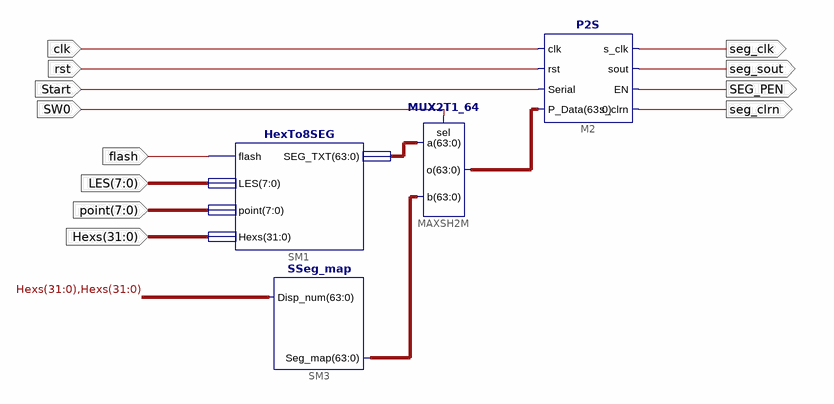
[diagram p0: schematic sheet 1]
// Xilinx ISE schematic SSeg7_Dev.sch (kintex7) as structural Verilog: 4 symbols, 12 ports
module SSeg7_Dev (
  input  Start,
  input  rst,
  input  clk,
  input  SW0,
  input  flash,
  input  [31:0] Hexs,
  input  [7:0] point,
  input  [7:0] LES,
  output seg_clk,
  output seg_sout,
  output SEG_PEN,
  output seg_clrn
);

  wire [63:0] SEGMENT, XLXN_2, XLXN_32;

  HexTo8SEG SM1 (.flash(flash), .LES(LES), .point(point), .Hexs(Hexs), .SEG_TXT(XLXN_32));
  MUX2T1_64 MAXSH2M (.b(XLXN_2), .sel(SW0), .a(XLXN_32), .o(SEGMENT));
  P2S M2 (
    .s_clrn(seg_clrn), .sout(seg_sout), .rst(rst), .EN(SEG_PEN), .Serial(Start), .clk(clk), .s_clk(seg_clk),
    .P_Data(SEGMENT));
  SSeg_map SM3 (.Disp_num({Hexs, Hexs}), .Seg_map(XLXN_2));
endmodule
